# EAGLE design reverb3 (EAGLE 9.5.2)
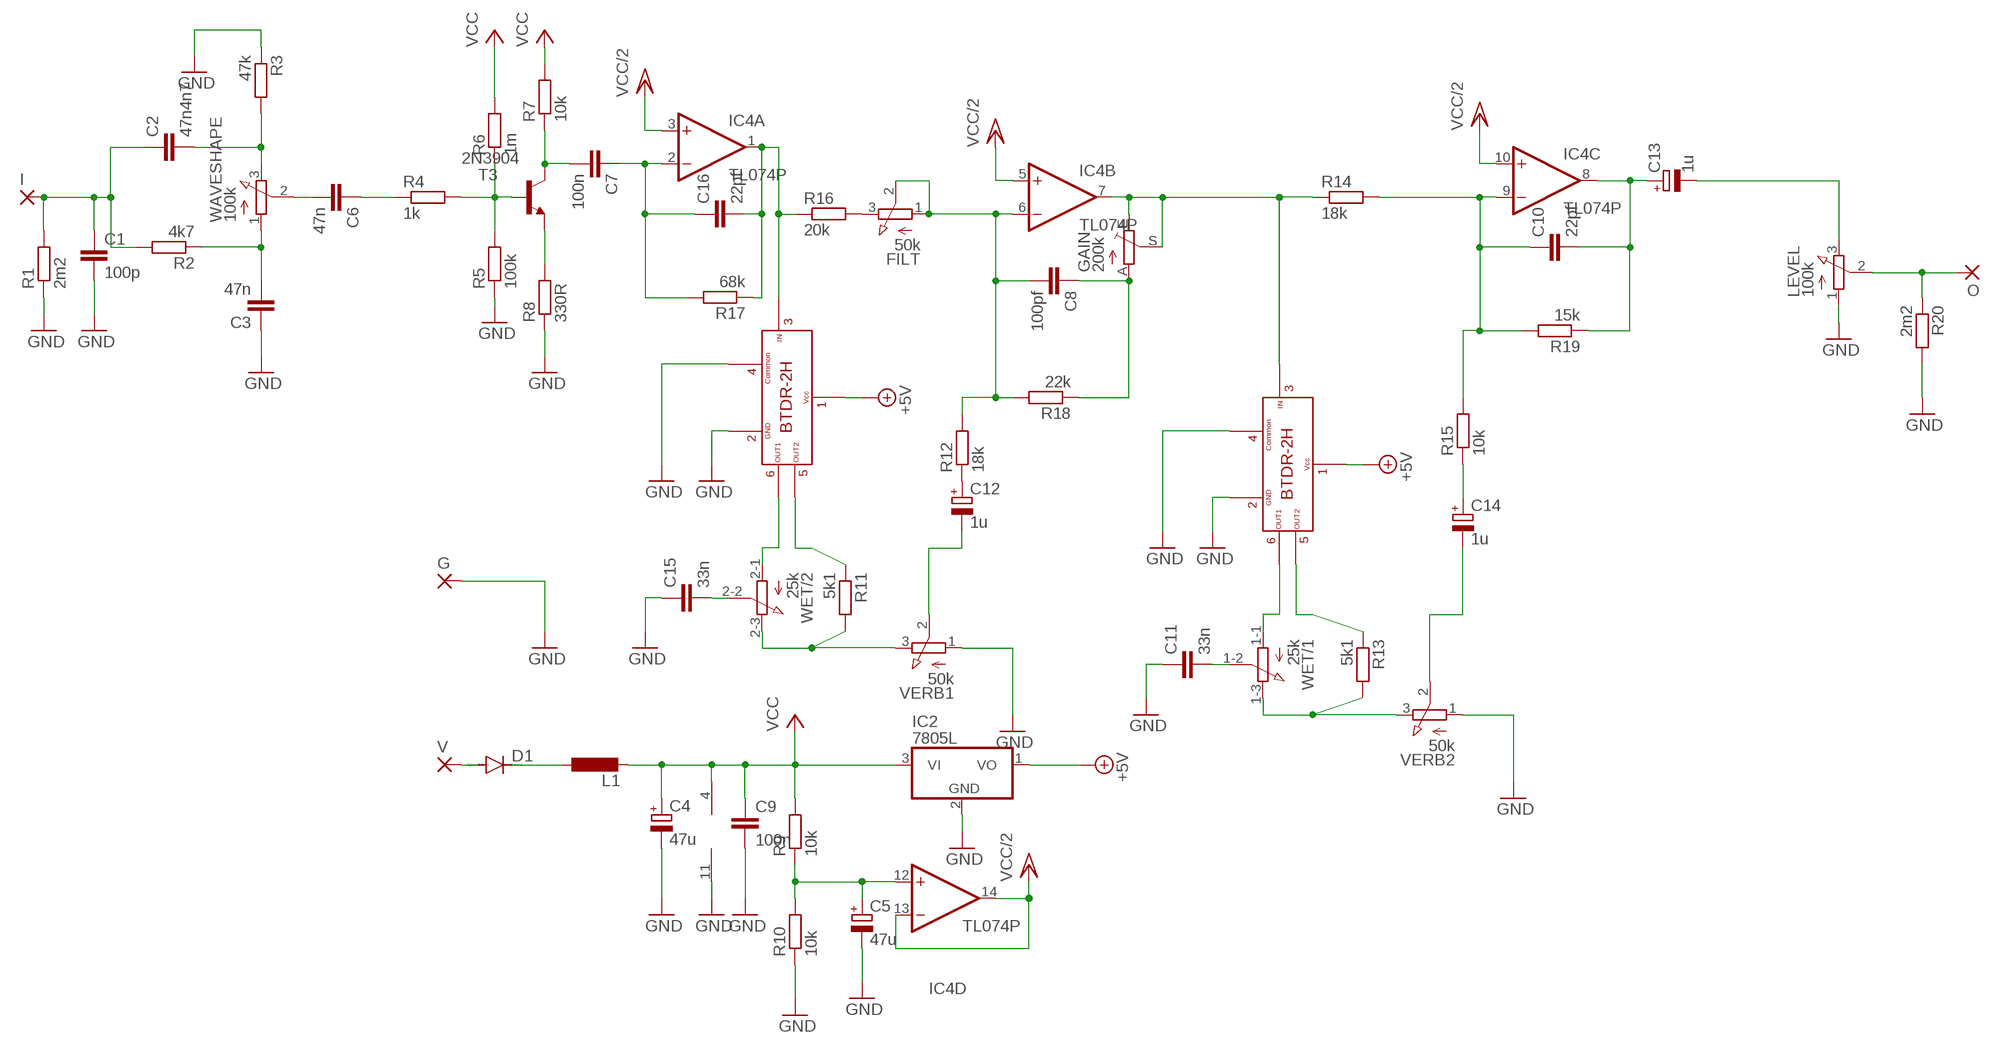
[diagram p0: schematic, sheet 1]

## Parts
BELTON1  BTDR-2H  [BTDR2]
C1  100p  C5/2.5  [S5MMHEXCAP]
C2  47n4n7  C5/2.5  [S5MMHEXCAP]
C3  47n  C5/2.5  [S5MMHEXCAP]
C4  47u  CPOL-EUE2-4  [E2-4]
C5  47u  CPOL-EUE2-4  [E2-4]
C6  47n  C5/2.5  [S5MMHEXCAP]
C7  100n  C5/2.5  [S5MMHEXCAP]
C8  100pf  C5/2.5  [S5MMHEXCAP]
C9  100n  C5/2.5  [S5MMHEXCAP]
C10  22pf  C5/2.5  [S5MMHEXCAP]
C11  33n  C5/2.5  [S5MMHEXCAP]
C12  1u  CPOL-EUE2-4  [E2-4]
C13  1u  CPOL-EUE2-4  [E2-4]
C14  1u  CPOL-EUE2-4  [E2-4]
C15  33n  C5/2.5  [S5MMHEXCAP]
C16  22pf  C5/2.5  [S5MMHEXCAP]
D1  1N4148DO35-7  [DO35-7]
FILT  50k  HEXPOT1  [3RP/1610N]
G  WIREPAD1,6/0,9  [1,6/0,9]
GAIN  200k  TRIM_EU-CT6  [CT6]
I  WIREPAD1,6/0,9  [1,6/0,9]
IC2  7805L  [TO92]
IC4  TL074P  [DIL14]
L1  L-EU0204/7  [0204/7]
LEVEL  100k  HEXPOT1  [3RP/1610N]
O  WIREPAD1,6/0,9  [1,6/0,9]
R1  2m2  R-EU_0207/7  [0207/7]
R2  4k7  R-EU_0207/7  [0207/7]
R3  47k  R-EU_0207/7  [0207/7]
R4  1k  R-EU_0207/7  [0207/7]
R5  100k  R-EU_0207/7  [0207/7]
R6  1m  R-EU_0207/7  [0207/7]
R7  10k  R-EU_0207/7  [0207/7]
R8  330R  R-EU_0207/7  [0207/7]
R9  10k  R-EU_0207/7  [0207/7]
R10  10k  R-EU_0207/7  [0207/7]
R11  5k1  R-EU_0207/7  [0207/7]
R12  18k  R-EU_0207/7  [0207/7]
R13  5k1  R-EU_0207/7  [0207/7]
R14  18k  R-EU_0207/7  [0207/7]
R15  10k  R-EU_0207/7  [0207/7]
R16  20k  R-EU_0207/7  [0207/7]
R17  68k  R-EU_0207/7  [0207/7]
R18  22k  R-EU_0207/7  [0207/7]
R19  15k  R-EU_0207/7  [0207/7]
R20  2m2  R-EU_0207/7  [0207/7]
T3  2N3904  [TO92]
U$2  BTDR-2H  [BTDR2]
V  WIREPAD1,6/0,9  [1,6/0,9]
VERB1  50k  HEXPOT1  [3RP/1610N]
VERB2  50k  HEXPOT1  [3RP/1610N]
WAVESHAPE  100k  HEXPOT1  [3RP/1610N]
WET  25k  3RP/1610G  [3RP/1610G]

## Nets
+5V: BELTON1.P$1 IC2.1(VO) U$2.P$1
GND: BELTON1.P$2 BELTON1.P$4 C1.2 C3.1 C4.- C5.- C9.2 C11.1 C15.1 G.1(P) IC2.2(GND) IC4.11(P:V-) LEVEL.1(A) R1.1 R3.1 R5.1 R8.1 R10.1 R20.2 U$2.P$2 U$2.P$4 VERB1.1(A) VERB2.1(A)
N$1: R4.2 R5.2 R6.1 T3.2(B)
N$2: C7.2 R7.1 T3.1(C)
N$3: R11.1 U$2.P$5
N$4: BELTON1.P$5 R13.1
N$5: BELTON1.P$6 WET.1-1(/1:A)
N$6: C7.1 C16.1 IC4.2(A:-IN) R17.2
N$7: R13.2 VERB2.3(E) WET.1-3(/1:E)
N$8: D1.C L1.1
N$9: C2.2 R3.2 WAVESHAPE.3(E)
N$10: C13.- LEVEL.3(E)
N$11: C14.- VERB2.2(S)
N$12: C11.2 WET.1-2(/1:S)
N$13: C10.1 IC4.9(C:-IN) R14.2 R15.2 R19.2
N$14: C14.+ R15.1
N$15: C6.1 R4.1
N$16: C8.2 FILT.1(A) FILT.2(S) IC4.6(B:-IN) R12.2 R18.2
N$17: C3.2 R2.1 WAVESHAPE.1(A)
N$18: R8.2 T3.3(E)
N$19: C1.1 C2.1 I.1(P) R1.2 R2.2
N$20: C6.2 WAVESHAPE.2(S)
N$21: LEVEL.2(S) O.1(P) R20.1
N$22: D1.A V.1(P)
N$23: BELTON1.P$3 GAIN.E GAIN.S IC4.7(B:OUT) R14.1
N$24: C10.2 C13.+ IC4.8(C:OUT) R19.1
N$25: U$2.P$6 WET.2-1(/2:A)
N$26: R11.2 VERB1.3(E) WET.2-3(/2:E)
N$27: C12.- VERB1.2(S)
N$28: C12.+ R12.1
N$29: FILT.3(E) R16.2
N$30: C15.2 WET.2-2(/2:S)
N$31: C8.1 GAIN.A R18.1
N$32: C16.2 IC4.1(A:OUT) R16.1 R17.1 U$2.P$3
N$33: C5.+ IC4.12(D:+IN) R9.1 R10.2
VCC: C4.+ C9.1 IC2.3(VI) IC4.4(P:V+) L1.2 R6.2 R7.2 R9.2
VCC/2: IC4.3(A:+IN) IC4.5(B:+IN) IC4.10(C:+IN) IC4.13(D:-IN) IC4.14(D:OUT)

## Library data of the parts
BELTON1 U$2 = belton_reverb_module:BTDR-2H: BTDR 2H - Digital Reverb Module - Belton/Accutronics - BTDR-2H Mr. Polo @ NeuroDrop Electronix
C1-C3 C6-C11 C15 C16 = hexcapacitor-wima:C: CAPACITOR naming: grid - package width
C4 C5 C12-C14 = hexresistor:CPOL-EU: POLARIZED CAPACITOR, European symbol; SPICEPREFIX: C
D1 = diode:1N4148: DIODE high speed (Philips)
FILT LEVEL VERB1 VERB2 WAVESHAPE = hexpedalpot:HEXPOT1: 16mm Potentiometer one level Source: http://www.alphapotentiometers.net/html/16mm_pot_2.html
G I O V = wirepad:WIREPAD: Wire PAD connect wire on PCB
GAIN = hexpedalpot:TRIM_EU-: POTENTIOMETER
IC2 = linear:78*: Positive VOLTAGE REGULATOR Source: http://cache.national.com/ds/LM/LM78L05.pdf http://www.fairchildsemi.com/ds/LM/LM7805.pdf
IC4 = linear:TL074: OP AMP
L1 = hexresistor:L-EU: INDUCTOR, European symbol; SPICEPREFIX: L
R1-R20 = hexresistor:R-EU_: RESISTOR, European symbol; SPICEPREFIX: R
T3 = transistor:2N3904: NPN TRANSISTOR
WET = hexpedalpot:3RP/1610G: 16mm Potentiometer two level Source: http://www.alphapotentiometers.net/html/16mm_pot_2.html

## Net classes
0 default: width 0.254 mm

## Board
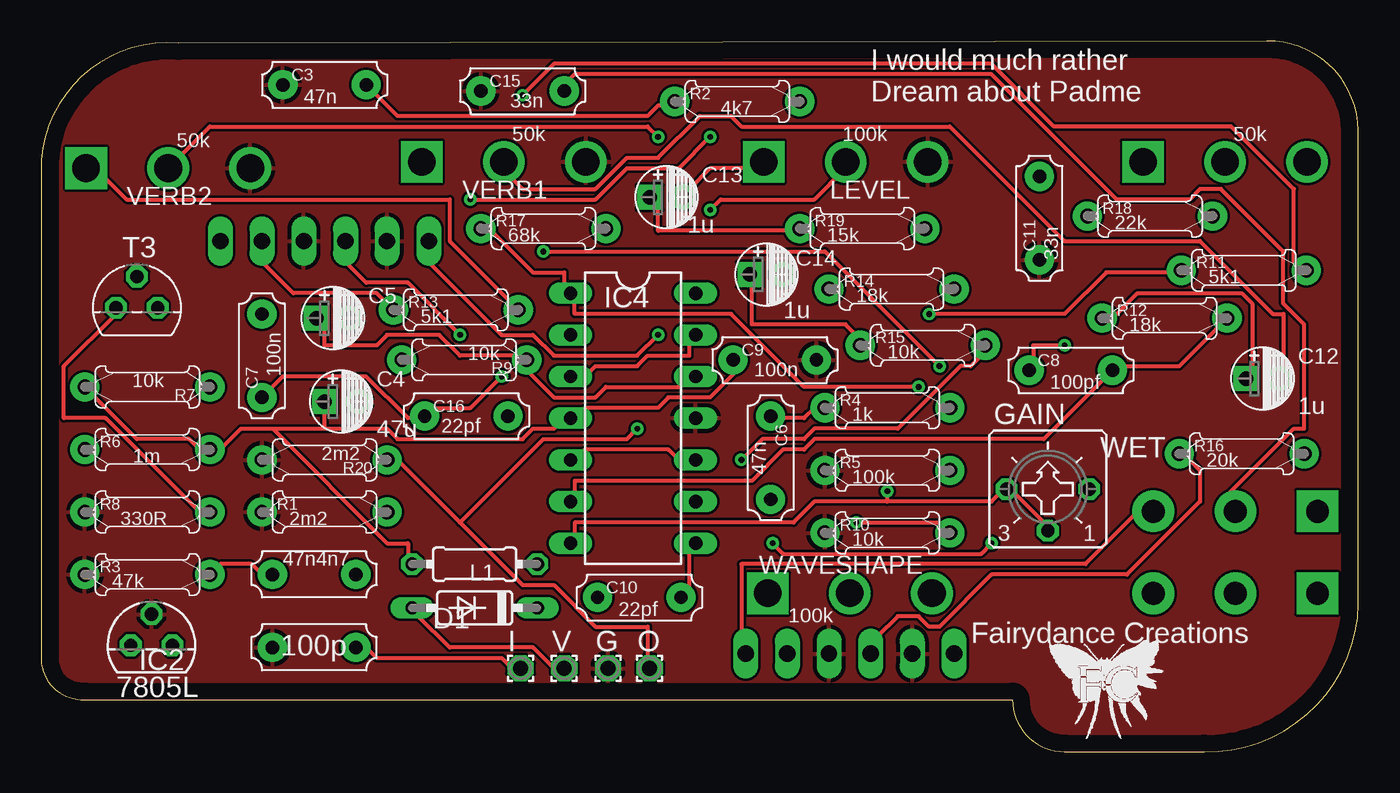
[diagram p1: board, top side]
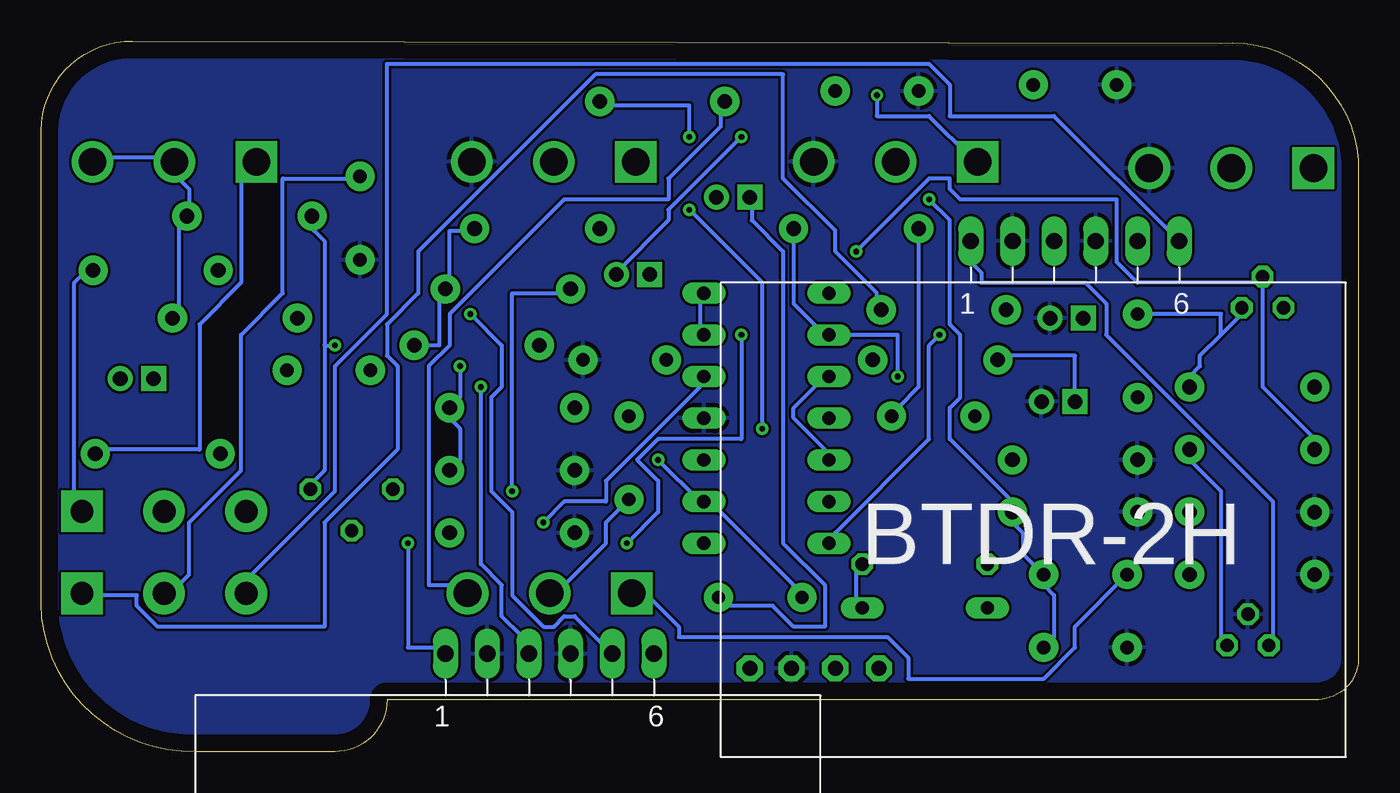
[diagram p2: board, bottom side, seen from below]

Size 80.26 x 43.31 mm. Coordinates in mm from the lower left corner, seen from the top.
Outline: 0,36.07 0,5.59 arc90 2.67,3.17 59.18,3.17 arc90 62.36,0 70.87,0 arc90 80.26,9.02 80.26,37.85 arc90 74.68,43.31 8.38,43.18 arc90 0,36.07
Copper layers (1*16): Top 0.035mm / dielectric 1.5mm / Bottom 0.035mm
Design rules "default": minimum track width 6mil, minimum drill 0.35mm, track to track 6mil, track to pad 6mil, pad to pad 6mil, via to via 6mil, smd to smd 6mil, copper to edge 40mil, drill to drill 6mil, minimum pad ring 10mil, minimum via ring 8mil, stop-mask expansion 4mil, vias tented up to drill 0mil, thermal gap 10mil

### Footprints (pad centres in the part's own frame; a part is rotated, then mirrored left to right if it is on the bottom)
BTDR2 = drill 1 long: P$1 3.81,-17.145; P$2 1.27,-17.145; P$3 -1.27,-17.145; P$4 -3.81,-17.145; P$5 -6.35,-17.145; P$6 -8.89,-17.145
S5MMHEXCAP = drill 0.813 pad 1.778: 1 -2.54,0; 2 2.54,0
E2-4 = drill 0.889 pad 1.524 square: + -1.016,0 | drill 0.889 pad 1.524: - 1.016,0
DO35-7 = drill 0.813 long: A 3.81,0; C -3.81,0
3RP/1610N = drill 1.676 pad 2.54: 1 -5,0; 2 0,0 | drill 1.676 pad 2.54 square: 3 5,0
1,6/0,9 = drill 0.914 pad 1.6 octagon: 1 0,0
CT6 = drill 0.813 octagon: A 2.515,0; E -2.515,0; S 0,-2.54
TO92 = drill 0.813 octagon: 1 -1.27,0; 2 0,1.905; 3 1.27,0
DIL14 = drill 0.813 long: 1 -7.62,-3.81; 2 -5.08,-3.81; 3 -2.54,-3.81; 4 0,-3.81; 5 2.54,-3.81; 6 5.08,-3.81; 7 7.62,-3.81; 8 7.62,3.81; 9 5.08,3.81; 10 2.54,3.81; 11 0,3.81; 12 -2.54,3.81; 13 -5.08,3.81; 14 -7.62,3.81
0204/7 = drill 0.813 octagon: 1 -3.81,0; 2 3.81,0
0207/7 = drill 0.889 pad 1.778: 1 -3.81,0; 2 3.81,0
TO92' = drill 0.813 octagon: 1 1.27,0; 2 0,1.905; 3 -1.27,0
3RP/1610G = drill 1.397 pad 2.54: 1-1 -5,0; 1-2 0,0; 2-1 -5,5; 2-2 0,5 | drill 1.397 pad 2.54 square: 1-3 5,0; 2-3 5,5

### Placement (x,y rotation side)
BELTON1  19.81,13.97 180 bottom
C1  16.64,6.35 180 top
C2  16.64,10.8 180 top
C3  17.27,40.64 0 top
C4  18.29,21.34 0 top
C5  17.78,26.42 0 top
C6  44.45,17.91 270 top
C7  13.46,24.13 90 top
C8  62.74,23.24 0 top
C9  44.7,23.88 0 top
C10  36.45,9.4 0 top
C11  60.83,32.51 90 top
C12  74.42,22.73 0 top
C13  38.1,33.78 0 top
C14  44.2,29.08 0 top
C15  29.34,40.26 0 top
C16  25.91,20.45 0 top
D1  26.42,8.76 180 top
FILT  72.14,35.94 180 top
G  34.54,5.08 0 top
GAIN  61.34,16 0 top
I  29.21,5.08 0 top
IC2  6.73,6.48 0 top
IC4  36.07,20.32 270 top
L1  26.42,11.43 180 top
LEVEL  49.02,35.94 180 top
O  37.08,5.08 0 top
R1  17.27,14.61 0 top
R2  42.42,39.62 0 top
R3  6.48,10.8 0 top
R4  51.56,20.95 0 top
R5  51.56,17.14 0 top
R6  6.48,18.41 0 top
R7  6.48,22.22 180 top
R8  6.48,14.61 0 top
R9  25.78,23.88 180 top
R10  51.56,13.34 0 top
R11  73.28,29.34 0 top
R12  68.45,26.42 0 top
R13  25.27,26.92 0 top
R14  51.82,28.19 0 top
R15  53.72,24.77 0 top
R16  73.15,18.16 0 top
R17  30.61,31.88 0 top
R18  67.56,32.64 0 top
R19  50.04,31.88 0 top
R20  17.27,17.78 180 top
T3  2N3904  [TO92']  5.84,27.05 0 top
U$2  51.82,-11.18 180 bottom
V  31.88,5.08 0 top
VERB1  28.19,35.94 180 top
VERB2  7.75,35.56 180 top
WAVESHAPE  49.28,9.65 180 top
WET  72.77,9.65 0 top

### Tracks (layer width: path | path; a pad name or v marks a point on that pad's centre or on a via)
+5V  (via drill 0.35)
  Top 0.254: v57.91,12.7 57.28,12.07 45.21,12.07 v44.58,12.7 | v37.59,25.4 36.32,24.13 31.24,24.13 29.97,25.4 28.07,25.4 23.62,29.84 BELTON1.P$1
  Bottom 0.254: BELTON1.P$1 23.62,29.84 22.99,29.21 22.99,28.57 16.64,28.57 15.37,27.3 15.37,25.4 5.21,15.24 5.21,6.99 IC2.1 | v57.91,12.7 57.91,6.35 56.01,6.35 U$2.P$1 | v44.58,12.7 42.67,14.61 42.67,16.51 43.94,17.78 42.67,19.05 37.59,19.05 v37.59,25.4
GND
  pour Bottom: 0.76,36.83 0.76,5.71 arc90 7.11,-0.63 82.04,-0.63 arc90 99.19,16.51 arc90 71.88,43.81 7.75,43.81 arc90
  pour Top: 0.76,36.99 0.76,5.08 arc90 7.11,-1.27 82.04,-1.27 arc90 101.41,18.1 arc90 74.42,45.09 7.24,45.09 arc90
N$1  (via drill 0.35)
  Top 0.254: v54.74,23.49 47.75,30.48 v30.61,30.48
  Bottom 0.254: R5.2 54.74,17.78 54.74,19.68 55.37,20.32 R4.2 54.74,21.59 v54.74,23.49 | 5.84,28.57 5.84,22.22 2.67,19.05 R6.1 | v30.61,30.48 26.16,34.92 24.89,34.92 24.89,34.29 24.26,33.66 14.73,33.66 14.73,29.84 13.46,28.57 5.84,28.57 | 5.84,28.57 T3.2
N$2
  Bottom 0.254: 8.38,25.4 9.65,24.13 9.65,23.49 10.29,22.86 R7.1 | 8.38,25.4 7.11,26.67 T3.1 | C7.2 8.38,26.67 8.38,25.4
N$3  (via drill 0.35)
  Top 0.254: v54.1,26.67 62.36,26.67 64.9,29.21 69.34,29.21 R11.1
  Bottom 0.254: U$2.P$5 47.75,8.25 48.39,8.25 49.02,7.62 49.66,7.62 51.56,9.53 51.56,14.61 52.83,15.88 52.83,21.59 52.2,22.22 52.2,24.77 v54.1,26.67
N$4
  Top 0.254: BELTON1.P$5 13.46,29.84 15.37,27.94 20.45,27.94 R13.1
N$5
  Bottom 0.254: BELTON1.P$6 18.54,38.73 24.89,38.73 24.89,40.64 26.16,41.91 59.18,41.91 59.18,26.67 62.36,23.49 62.36,15.88 67.44,10.8 67.44,10.16 WET.1-1
N$6  (via drill 0.35)
  Top 0.254: C7.1 14.73,22.86 19.81,22.86 22.35,20.32 22.99,20.32 C16.1 23.62,20.95 26.16,20.95 v28.07,22.86
  Bottom 0.254: R17.2 34.42,27.3 32.51,25.4 IC4.2 28.07,25.4 v28.07,22.86
N$7
  Top 0.254: R13.2 24.89,31.11 24.89,33.66 5.21,33.66 3.3,35.56 VERB2.3
  Bottom 0.254: WET.1-3 77.6,9.53 74.42,9.53 74.42,8.89 73.15,7.62 62.99,7.62 62.99,13.97 58.55,18.41 58.55,23.49 59.18,24.13 59.18,26.04 57.28,27.94 57.28,30.48 46.48,41.27 35.05,41.27 35.05,34.92 31.88,31.75 31.88,30.48 29.34,27.94 29.34,27.3 R13.2
N$8
  Bottom 0.254: D1.C 30.61,8.89 30.61,11.43 L1.1
N$9
  Top 0.254: R3.2 10.92,11.43 12.83,11.43 13.46,10.8 C2.2
  Bottom 0.254: C2.2 17.27,7.62 17.27,6.35 19.18,4.45 27.43,4.45 27.43,5.71 28.7,6.99 41.4,6.99 41.4,7.62 43.94,10.16 WAVESHAPE.3
N$10
  Top 0.254: C13.- 39.5,34.29 40.77,35.56 43.94,35.56 LEVEL.3
N$11  (via drill 0.35)
  Top 0.254: v37.59,37.46 36.96,38.1 10.29,38.1 VERB2.2
  Bottom 0.254: v37.59,37.46 42.04,33.02 42.04,32.38 45.21,29.21 C14.-
N$12
  Bottom 0.254: C11.2 61.09,34.92 65.53,34.92 65.53,27.94 68.07,25.4 68.07,17.14 71.25,13.97 71.25,10.8 72.52,9.53 WET.1-2
N$13  (via drill 0.35)
  Top 0.254: v42.67,17.78 43.94,19.05 46.48,19.05 47.12,19.68 52.2,19.68 56.01,23.49 56.64,23.49 57.91,24.77 R15.2
  Bottom 0.254: C10.1 34.42,9.53 34.42,10.16 39.5,15.24 IC4.9 40.13,15.24 v42.67,17.78 | R15.2 56.01,24.77 56.01,27.94 R14.2 55.37,28.57 55.37,31.75 54.1,31.75 R19.2
N$14
  Top 0.254: C14.+ 43.31,28.57 43.31,26.04 49.02,26.04 50.29,24.77 R15.1
N$15
  Top 0.254: R4.1 47.12,20.95 46.48,20.32 44.58,20.32 C6.1
N$16
  Top 0.254: IC4.6 32.51,15.24 32.51,16.51 43.31,16.51 45.21,18.41 46.48,18.41 47.12,19.05 61.09,19.05 C8.2 65.53,23.49 69.34,23.49 R12.2
  Bottom 0.254: R12.2 71.88,26.67 71.88,32.38 R18.2 71.25,33.02 71.25,34.29 71.88,34.92 71.88,35.56 FILT.2 72.52,36.2 76.96,36.2 FILT.1
N$17
  Top 0.254: C3.2 21.72,38.73 36.96,38.73 37.59,39.37 38.23,39.37 R2.1
  Bottom 0.254: WAVESHAPE.1 54.74,10.16 56.64,10.16 56.64,23.49 55.37,24.77 55.37,26.67 48.39,33.66 42.04,33.66 42.04,34.92 38.86,38.1 38.86,39.37 R2.1
N$18
  Top 0.254: R8.2 9.65,14.61 3.94,20.32 1.4,20.32 1.4,23.49 4.57,26.67 T3.3
N$19  (via drill 0.35)
  Top 0.254: C1.1 19.81,6.35 20.45,5.71 28.07,5.71 28.7,5.08 I.1 | v40.77,37.46 38.86,35.56 35.69,35.56 33.78,33.66 v26.16,33.66
  Bottom 0.254: v40.77,37.46 40.77,39.37 45.85,39.37 R2.2 | v26.16,33.66 24.89,32.38 24.89,26.04 24.26,25.4 24.26,21.59 24.89,20.95 24.89,19.05 21.08,15.24 R1.2 21.08,13.97 20.45,13.34 20.45,12.07 C2.1 19.18,10.16 18.54,9.53 18.54,6.99 C1.1
N$20
  Bottom 0.254: C6.2 45.85,13.97 45.85,12.7 49.02,9.53 WAVESHAPE.2
N$21  (via drill 0.35)
  Top 0.254: 25.53,13.97 21.72,17.78 R20.1 | 25.53,13.97 29.34,10.16 31.24,10.16 33.78,7.62 36.96,7.62 36.96,5.08 O.1 | v40.77,33.02 41.4,33.66 47.12,33.66 49.02,35.56 LEVEL.2 | v36.32,19.68 35.69,19.05 30.61,19.05 25.53,13.97
  Bottom 0.254: v40.77,33.02 36.32,28.57 v36.32,19.68
N$22
  Top 0.254: V.1 31.24,5.08 29.97,6.35 24.89,6.35 22.99,8.25 D1.A
N$23  (via drill 0.35)
  Top 0.254: 51.56,15.24 57.91,15.24 58.55,15.88 GAIN.E 59.18,15.88 61.09,13.97 GAIN.S | 51.56,15.24 47.12,15.24 45.85,13.97 32.51,13.97 32.51,12.7 IC4.7 | BELTON1.P$3 18.54,29.84 19.81,28.57 22.35,28.57 v25.53,25.4 | 51.56,15.24 v51.56,15.88
  Bottom 0.254: v25.53,25.4 26.16,24.77 26.16,19.05 31.88,13.34 31.88,12.7 IC4.7 | v51.56,15.88 51.56,27.94 48.39,27.94 R14.1
N$24
  Top 0.254: IC4.8 39.5,12.7 39.5,9.53 C10.2 | C13.+ 37.59,33.66 37.59,31.75 45.85,31.75 R19.1
  Bottom 0.254: C10.2 38.86,8.89 35.69,8.89 34.42,7.62 32.51,7.62 32.51,10.16 35.05,12.7 35.05,30.48 36.96,32.38 36.96,33.66 C13.+
N$25
  Top 0.254: U$2.P$6 42.67,6.35 42.67,11.43 63.63,11.43 66.8,14.61 67.44,14.61 WET.2-1
N$26  (via drill 0.35)
  Top 0.254: v29.34,40.01 31.24,41.91 57.91,41.91 61.72,38.1 72.52,38.1 76.33,34.29 76.33,29.84 76.96,29.84 R11.2
  Bottom 0.254: R11.2 77.6,29.21 78.23,28.57 78.23,15.24 WET.2-3 | v29.34,40.01 29.34,38.73 26.16,38.73 23.62,36.2 VERB1.3
N$27
  Top 0.254: C12.- 75.69,22.86 75.69,26.67 75.06,26.67 70.61,31.11 62.36,31.11 55.37,38.1 42.67,38.1 42.04,38.73 40.13,38.73 37.59,36.2 35.69,36.2 33.78,34.29 29.34,34.29 28.07,35.56 VERB1.2
N$28
  Top 0.254: C12.+ 73.79,22.86 73.79,27.3 73.15,27.94 66.8,27.94 65.53,26.67 64.9,26.67 R12.1
N$29
  Bottom 0.254: R16.2 76.96,18.41 70.61,18.41 70.61,26.04 68.07,28.57 68.07,34.92 67.44,35.56 FILT.3
N$30
  Top 0.254: C15.2 31.88,40.64 32.51,41.27 57.91,41.27 65.53,33.66 69.98,33.66 70.61,34.29 71.88,34.29 75.69,30.48 75.69,27.3 76.96,26.04 76.96,19.68 76.33,19.68 71.88,15.24 71.88,14.61 72.52,14.61 WET.2-2
N$31  (via drill 0.35)
  Top 0.254: v62.36,24.77 60.45,24.77 60.45,23.49 C8.1
  Bottom 0.254: 62.99,24.77 62.99,31.11 63.63,31.75 63.63,32.38 R18.1 | 62.99,24.77 62.99,17.14 63.63,16.51 GAIN.A | 62.99,24.77 v62.36,24.77
N$32  (via drill 0.35)
  Top 0.254: R17.1 26.8,31.75 27.43,31.75 29.97,29.21 31.88,29.21 31.88,27.94 IC4.1 32.51,27.94 32.51,26.67 42.04,26.67 46.48,22.22 v53.47,22.22 | U$2.P$3 50.93,6.35 50.93,6.99 52.2,8.25 53.47,8.25 54.1,7.62 54.74,7.62 57.91,10.8 66.17,10.8 70.61,15.24 70.61,17.14 69.98,17.78 69.34,17.78 R16.1
  Bottom 0.254: R17.1 26.8,22.22 28.07,20.95 C16.2 | v53.47,22.22 53.47,11.43 52.2,10.16 52.2,8.25 50.93,6.99 50.93,6.35 U$2.P$3
N$33  (via drill 0.35)
  Top 0.254: IC4.12 39.5,22.86 38.86,22.22 34.42,22.22 33.78,21.59 31.24,21.59 29.34,23.49 R9.1 29.34,24.13 25.53,24.13 24.26,25.4 21.08,25.4 20.45,24.77 17.27,24.77 17.27,26.04 C5.+ | R10.2 54.74,13.97 v49.66,13.97
  Bottom 0.254: v49.66,13.97 48.39,15.24 45.85,15.24 45.85,16.51 40.13,22.22 40.13,22.86 IC4.12
VCC
  Top 0.254: C9.1 42.67,23.49 40.77,21.59 38.23,21.59 37.59,20.95 33.15,20.95 32.51,20.32 IC4.4 31.88,20.32 31.24,19.68 29.97,19.68 29.34,19.05 21.72,19.05 21.08,19.68 17.27,19.68 | 14.1,19.68 21.08,12.7 22.35,12.7 22.35,11.43 L1.2 | 14.1,19.68 12.19,19.68 10.92,18.41 R6.2 9.65,18.41 9.02,19.05 5.84,19.05 R7.2 | 17.27,19.68 C4.+ | 14.1,19.68 17.27,19.68
  Bottom 0.254: R6.2 10.29,17.78 8.38,15.88 8.38,6.99 IC2.3 | C4.+ 17.27,24.13 21.72,24.13 R9.2
VCC/2
  Top 0.254: IC4.10 38.86,17.78 38.23,18.41 33.15,18.41 32.51,17.78 IC4.5 | IC4.3 33.15,22.86 33.78,23.49 36.32,23.49 36.96,24.13 39.5,24.13 39.5,25.4 IC4.13
  Bottom 0.254: IC4.13 40.13,25.4 40.13,27.94 IC4.14 | IC4.3 32.51,22.86 34.42,20.95 34.42,20.32 32.51,18.41 32.51,17.78 IC4.5

### Text on the board
tNames: I would much rather / Dream about Padme | Fairydance Creations | 100p